# Altium schematic sheet HalfBridge.SchDoc
size A4
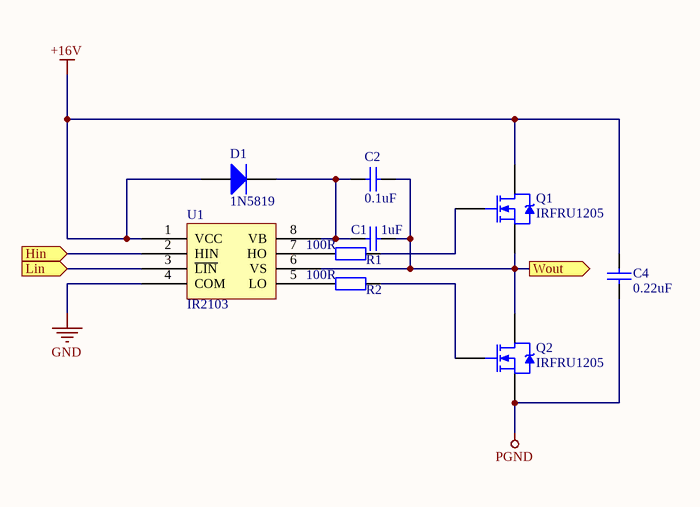
[diagram p0: HalfBridge.SchDoc]

## Parts
C1  1uF  [0603]
C2  0.1uF  [0603]
C4  0.22uF  [0603]
D1  1N5819  [SOD-123]
Q1  IRFRU1205  [TO-252]
Q2  IRFRU1205  [TO-252]
R1  100R  [0603]
R2  100R  [0603]
U1  IR2103  [SOIC-8]

## Ports
Hin (in), Lin (in), Wout (out)

## Nets
+16V: C4.2 D1.A Q1.2(D) U1.1(VCC)
GND: U1.4(COM)
PGND: C4.1 Q2.3(S)
Hin: U1.2(HIN) ; port Hin
Lin: U1.3(~{LIN}) ; port Lin
Wout: C1.2 C2.2 Q1.3(S) Q2.2(D) U1.6(VS) ; port Wout
NetC1_1: C1.1 C2.1 D1.K U1.8(VB)
NetQ1_1: Q1.1(G) R1.2
NetQ2_1: Q2.1(G) R2.2
NetR1_1: R1.1 U1.7(HO)
NetR2_1: R2.1 U1.5(LO)

## Library data of the parts
C1 C2 C4 = cap
D1 = diode
R1 R2 = res